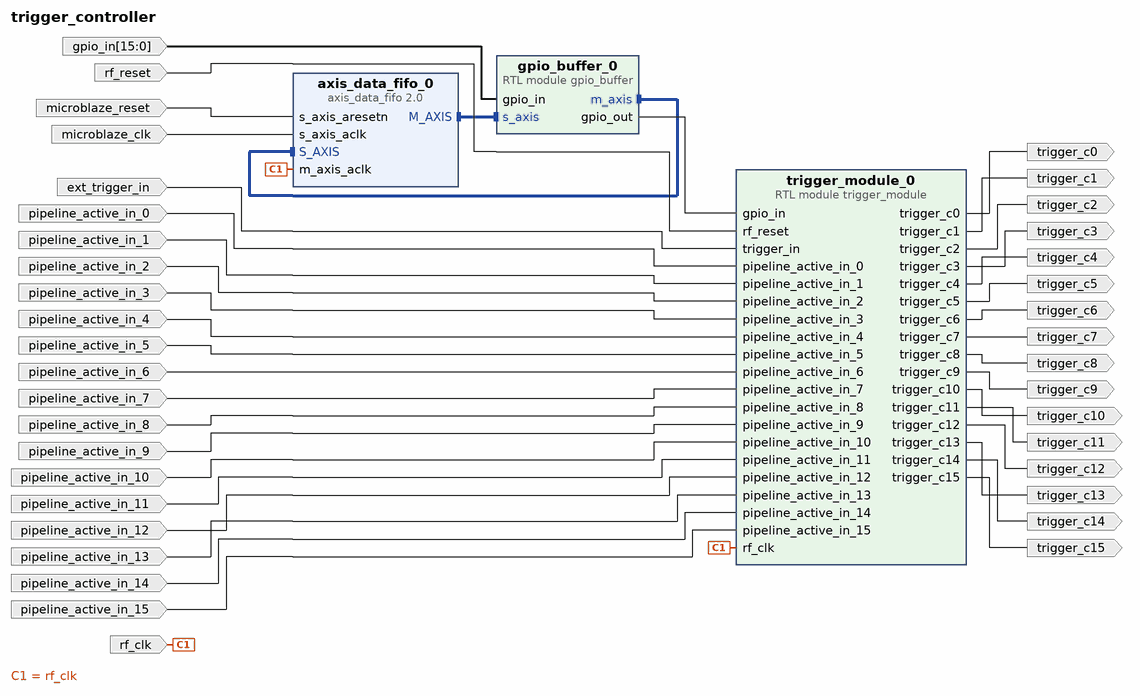
[diagram p0: block diagram of the top level]
# Vivado block design trigger_controller, xczu29dr-ffvf1760-2-e, Vivado 2019.1
create_bd_design trigger_controller

create_bd_port -dir I -type clk rf_clk
set_property -dict {CONFIG.FREQ_HZ 250000000} [get_bd_ports rf_clk]
create_bd_port -dir I -type rst rf_reset
create_bd_port -dir I -from 15 -to 0 -type data gpio_in
create_bd_port -dir I -type clk microblaze_clk
set_property -dict {CONFIG.FREQ_HZ 100000000} [get_bd_ports microblaze_clk]
create_bd_port -dir I -type rst microblaze_reset
create_bd_port -dir I ext_trigger_in
create_bd_port -dir I pipeline_active_in_0
create_bd_port -dir I pipeline_active_in_1
create_bd_port -dir I pipeline_active_in_2
create_bd_port -dir I pipeline_active_in_3
create_bd_port -dir O trigger_c3
create_bd_port -dir O trigger_c2
create_bd_port -dir O trigger_c1
create_bd_port -dir O trigger_c0
create_bd_port -dir I pipeline_active_in_4
create_bd_port -dir I pipeline_active_in_5
create_bd_port -dir I pipeline_active_in_6
create_bd_port -dir I pipeline_active_in_7
create_bd_port -dir I pipeline_active_in_8
create_bd_port -dir I pipeline_active_in_9
create_bd_port -dir I pipeline_active_in_10
create_bd_port -dir I pipeline_active_in_11
create_bd_port -dir I pipeline_active_in_12
create_bd_port -dir I pipeline_active_in_13
create_bd_port -dir I pipeline_active_in_14
create_bd_port -dir I pipeline_active_in_15
create_bd_port -dir O trigger_c15
create_bd_port -dir O trigger_c14
create_bd_port -dir O trigger_c13
create_bd_port -dir O trigger_c12
create_bd_port -dir O trigger_c10
create_bd_port -dir O trigger_c11
create_bd_port -dir O trigger_c4
create_bd_port -dir O trigger_c5
create_bd_port -dir O trigger_c6
create_bd_port -dir O trigger_c7
create_bd_port -dir O trigger_c8
create_bd_port -dir O trigger_c9

create_bd_cell -type ip -vlnv xilinx.com:ip:axis_data_fifo:2.0 axis_data_fifo_0
set_property -dict {CONFIG.FIFO_DEPTH 16 CONFIG.IS_ACLK_ASYNC 1 CONFIG.TDATA_NUM_BYTES 2} [get_bd_cells axis_data_fifo_0]
create_bd_cell -type module -reference trigger_module trigger_module_0
create_bd_cell -type module -reference gpio_buffer gpio_buffer_0

# ---- connections ----

connect_bd_intf_net [get_bd_intf_pins axis_data_fifo_0/S_AXIS] [get_bd_intf_pins gpio_buffer_0/m_axis]
connect_bd_intf_net [get_bd_intf_pins axis_data_fifo_0/M_AXIS] [get_bd_intf_pins gpio_buffer_0/s_axis]
connect_bd_net [get_bd_ports rf_reset] [get_bd_pins trigger_module_0/rf_reset]
connect_bd_net [get_bd_ports microblaze_reset] [get_bd_pins axis_data_fifo_0/s_axis_aresetn]
connect_bd_net [get_bd_ports microblaze_clk] [get_bd_pins axis_data_fifo_0/s_axis_aclk]
connect_bd_net [get_bd_ports rf_clk] [get_bd_pins axis_data_fifo_0/m_axis_aclk] [get_bd_pins trigger_module_0/rf_clk]
connect_bd_net [get_bd_ports gpio_in] [get_bd_pins gpio_buffer_0/gpio_in]
connect_bd_net [get_bd_pins gpio_buffer_0/gpio_out] [get_bd_pins trigger_module_0/gpio_in]
connect_bd_net -net trigger_in_0_1 [get_bd_ports ext_trigger_in] [get_bd_pins trigger_module_0/trigger_in]
connect_bd_net -net pipeline_active_in_0_0_1 [get_bd_ports pipeline_active_in_0] [get_bd_pins trigger_module_0/pipeline_active_in_0]
connect_bd_net -net pipeline_active_in_1_0_1 [get_bd_ports pipeline_active_in_1] [get_bd_pins trigger_module_0/pipeline_active_in_1]
connect_bd_net -net pipeline_active_in_2_0_1 [get_bd_ports pipeline_active_in_2] [get_bd_pins trigger_module_0/pipeline_active_in_2]
connect_bd_net -net pipeline_active_in_3_0_1 [get_bd_ports pipeline_active_in_3] [get_bd_pins trigger_module_0/pipeline_active_in_3]
connect_bd_net [get_bd_pins trigger_module_0/trigger_c3] [get_bd_ports trigger_c3]
connect_bd_net [get_bd_pins trigger_module_0/trigger_c2] [get_bd_ports trigger_c2]
connect_bd_net [get_bd_pins trigger_module_0/trigger_c1] [get_bd_ports trigger_c1]
connect_bd_net [get_bd_pins trigger_module_0/trigger_c0] [get_bd_ports trigger_c0]
connect_bd_net -net pipeline_active_in_4_0_1 [get_bd_ports pipeline_active_in_4] [get_bd_pins trigger_module_0/pipeline_active_in_4]
connect_bd_net -net pipeline_active_in_5_0_1 [get_bd_ports pipeline_active_in_5] [get_bd_pins trigger_module_0/pipeline_active_in_5]
connect_bd_net -net pipeline_active_in_6_0_1 [get_bd_ports pipeline_active_in_6] [get_bd_pins trigger_module_0/pipeline_active_in_6]
connect_bd_net -net pipeline_active_in_7_0_1 [get_bd_ports pipeline_active_in_7] [get_bd_pins trigger_module_0/pipeline_active_in_7]
connect_bd_net -net pipeline_active_in_8_0_1 [get_bd_ports pipeline_active_in_8] [get_bd_pins trigger_module_0/pipeline_active_in_8]
connect_bd_net -net pipeline_active_in_9_0_1 [get_bd_ports pipeline_active_in_9] [get_bd_pins trigger_module_0/pipeline_active_in_9]
connect_bd_net -net pipeline_active_in_10_0_1 [get_bd_ports pipeline_active_in_10] [get_bd_pins trigger_module_0/pipeline_active_in_10]
connect_bd_net -net pipeline_active_in_11_0_1 [get_bd_ports pipeline_active_in_11] [get_bd_pins trigger_module_0/pipeline_active_in_11]
connect_bd_net -net pipeline_active_in_12_0_1 [get_bd_ports pipeline_active_in_12] [get_bd_pins trigger_module_0/pipeline_active_in_12]
connect_bd_net -net pipeline_active_in_13_0_1 [get_bd_ports pipeline_active_in_13] [get_bd_pins trigger_module_0/pipeline_active_in_13]
connect_bd_net -net pipeline_active_in_14_0_1 [get_bd_ports pipeline_active_in_14] [get_bd_pins trigger_module_0/pipeline_active_in_14]
connect_bd_net -net pipeline_active_in_15_0_1 [get_bd_ports pipeline_active_in_15] [get_bd_pins trigger_module_0/pipeline_active_in_15]
connect_bd_net [get_bd_pins trigger_module_0/trigger_c15] [get_bd_ports trigger_c15]
connect_bd_net [get_bd_pins trigger_module_0/trigger_c14] [get_bd_ports trigger_c14]
connect_bd_net [get_bd_pins trigger_module_0/trigger_c13] [get_bd_ports trigger_c13]
connect_bd_net [get_bd_pins trigger_module_0/trigger_c12] [get_bd_ports trigger_c12]
connect_bd_net [get_bd_pins trigger_module_0/trigger_c10] [get_bd_ports trigger_c10]
connect_bd_net [get_bd_pins trigger_module_0/trigger_c11] [get_bd_ports trigger_c11]
connect_bd_net [get_bd_pins trigger_module_0/trigger_c4] [get_bd_ports trigger_c4]
connect_bd_net [get_bd_pins trigger_module_0/trigger_c5] [get_bd_ports trigger_c5]
connect_bd_net [get_bd_pins trigger_module_0/trigger_c6] [get_bd_ports trigger_c6]
connect_bd_net [get_bd_pins trigger_module_0/trigger_c7] [get_bd_ports trigger_c7]
connect_bd_net [get_bd_pins trigger_module_0/trigger_c8] [get_bd_ports trigger_c8]
connect_bd_net [get_bd_pins trigger_module_0/trigger_c9] [get_bd_ports trigger_c9]

validate_bd_design
save_bd_design
